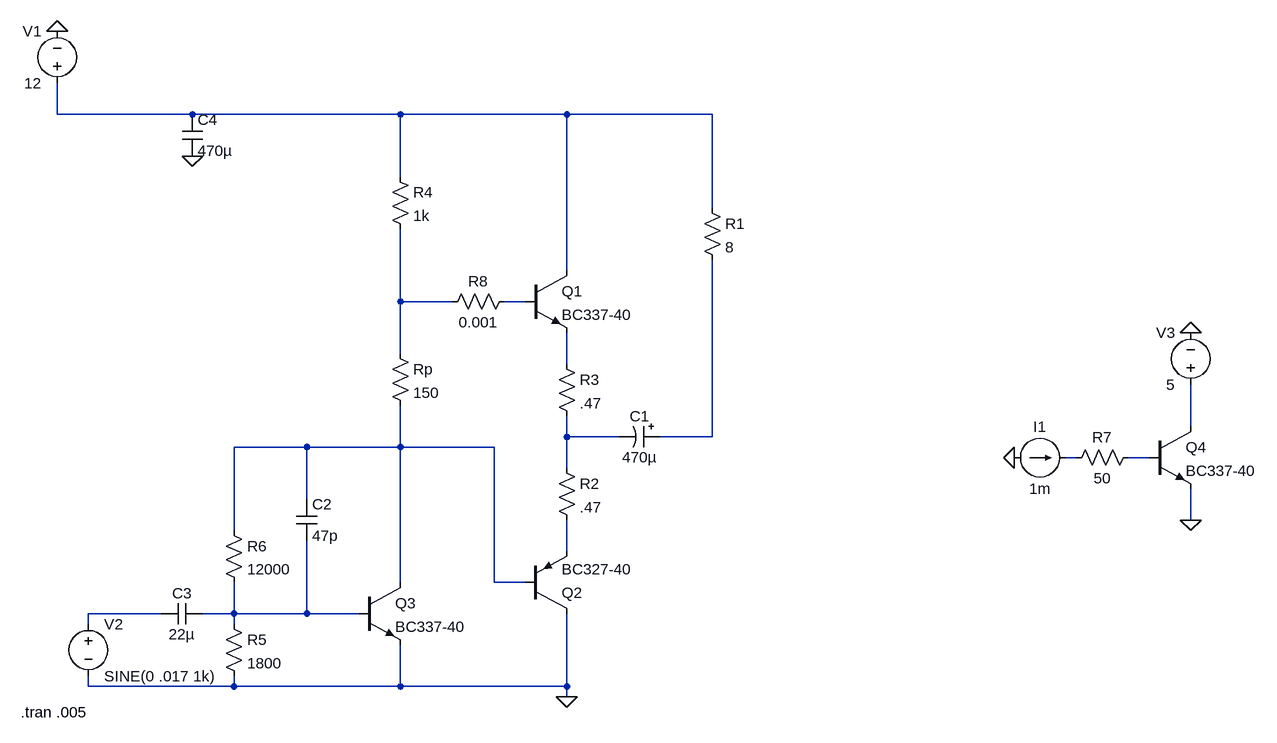
[diagram p0: schematic Problema 5 TP2.asc]
Problema 5 TP2.asc, the LTspice schematic file:
Version 4
SHEET 1 1872 1112
WIRE 32 176 32 128
WIRE 240 176 32 176
WIRE 560 176 240 176
WIRE 816 176 560 176
WIRE 1040 176 816 176
WIRE 560 272 560 176
WIRE 1040 320 1040 176
WIRE 816 416 816 176
WIRE 560 464 560 352
WIRE 640 464 560 464
WIRE 752 464 720 464
WIRE 560 544 560 464
WIRE 816 560 816 512
WIRE 1776 656 1776 592
WIRE 816 672 816 640
WIRE 896 672 816 672
WIRE 1040 672 1040 400
WIRE 1040 672 960 672
WIRE 416 688 304 688
WIRE 560 688 560 624
WIRE 560 688 416 688
WIRE 704 688 560 688
WIRE 1600 704 1584 704
WIRE 1712 704 1680 704
WIRE 816 720 816 672
WIRE 416 768 416 688
WIRE 1776 800 1776 752
WIRE 304 816 304 688
WIRE 816 848 816 800
WIRE 560 896 560 688
WIRE 704 896 704 688
WIRE 752 896 704 896
WIRE 192 944 80 944
WIRE 304 944 304 896
WIRE 304 944 256 944
WIRE 416 944 416 832
WIRE 416 944 304 944
WIRE 496 944 416 944
WIRE 80 960 80 944
WIRE 304 960 304 944
WIRE 80 1056 80 1040
WIRE 304 1056 304 1040
WIRE 304 1056 80 1056
WIRE 560 1056 560 992
WIRE 560 1056 304 1056
WIRE 816 1056 816 944
WIRE 816 1056 560 1056
WIRE 816 1072 816 1056
FLAG 32 48 0
FLAG 816 1072 0
FLAG 240 240 0
FLAG 1504 704 0
FLAG 1776 800 0
FLAG 1776 512 0
SYMBOL voltage 32 144 R180
WINDOW 0 24 96 Left 2
WINDOW 3 24 16 Left 2
SYMATTR InstName V1
SYMATTR Value 12
SYMBOL polcap 960 656 R90
WINDOW 0 0 32 VBottom 2
WINDOW 3 32 32 VTop 2
SYMATTR InstName C1
SYMATTR Value 470µ
SYMATTR Description Capacitor
SYMATTR Type cap
SYMATTR SpiceLine V=2 Irms=4.74342 Rser=0.01 Lser=0 mfg="KEMET" pn="A700X477M002ATE010" type="Al electrolytic"
SYMBOL res 1024 304 R0
SYMATTR InstName R1
SYMATTR Value 8
SYMBOL npn 752 416 R0
SYMATTR InstName Q1
SYMATTR Value BC337-40
SYMBOL pnp 752 944 M180
SYMATTR InstName Q2
SYMATTR Value BC327-40
SYMBOL res 800 704 R0
SYMATTR InstName R2
SYMATTR Value .47
SYMBOL res 800 544 R0
SYMATTR InstName R3
SYMATTR Value .47
SYMBOL res 544 256 R0
SYMATTR InstName R4
SYMATTR Value 1k
SYMBOL res 544 528 R0
SYMATTR InstName Rp
SYMATTR Value 150
SYMBOL npn 496 896 R0
SYMATTR InstName Q3
SYMATTR Value BC337-40
SYMBOL cap 400 768 R0
SYMATTR InstName C2
SYMATTR Value 47p
SYMBOL res 288 944 R0
SYMATTR InstName R5
SYMATTR Value 1800
SYMBOL res 288 800 R0
SYMATTR InstName R6
SYMATTR Value 12000
SYMBOL voltage 80 944 R0
WINDOW 123 0 0 Left 0
WINDOW 39 0 0 Left 0
SYMATTR InstName V2
SYMATTR Value SINE(0 .017 1k)
SYMBOL cap 256 928 R90
WINDOW 0 0 32 VBottom 2
WINDOW 3 32 32 VTop 2
SYMATTR InstName C3
SYMATTR Value 22µ
SYMBOL cap 224 176 R0
SYMATTR InstName C4
SYMATTR Value 470µ
SYMBOL npn 1712 656 R0
SYMATTR InstName Q4
SYMATTR Value BC337-40
SYMBOL current 1504 704 R270
WINDOW 0 32 40 VTop 2
WINDOW 3 -32 40 VBottom 2
SYMATTR InstName I1
SYMATTR Value 1m
SYMBOL voltage 1776 608 R180
WINDOW 0 24 96 Left 2
WINDOW 3 24 16 Left 2
SYMATTR InstName V3
SYMATTR Value 5
SYMBOL res 1696 688 R90
WINDOW 0 0 56 VBottom 2
WINDOW 3 32 56 VTop 2
SYMATTR InstName R7
SYMATTR Value 50
SYMBOL res 736 448 R90
WINDOW 0 0 56 VBottom 2
WINDOW 3 32 56 VTop 2
SYMATTR InstName R8
SYMATTR Value 0.001
TEXT -24 1096 Left 2 !.tran .005

The netlist it stands for:
* Problema 5 TP2.asc
V1 N001 0 12
C1 N007 N006 470µ V=2 Irms=4.74342 Rser=0.01 Lser=0 mfg="KEMET" pn="A700X477M002ATE010" type="Al electrolytic"
R1 N001 N007 8
Q1 N001 N003 N004 0 BC337-40
Q2 0 N008 N011 0 BC327-40
R2 N006 N011 .47
R3 N004 N006 .47
R4 N001 N002 1k
Rp N002 N008 150
Q3 N008 N013 0 0 BC337-40
C2 N008 N013 47p
R5 N013 0 1800
R6 N008 N013 12000
V2 N012 0 SINE(0 .017 1k)
C3 N013 N012 22µ
C4 N001 0 470µ
Q4 N005 N010 0 0 BC337-40
I1 0 N009 1m
V3 N005 0 5
R7 N010 N009 50
R8 N003 N002 0.001
.model NPN NPN
.model PNP PNP
.lib standard.bjt
.tran .005
.backanno
.end